# Altium project 红眼.PrjPcb
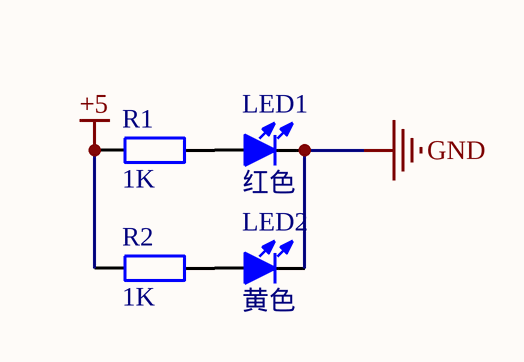
[diagram p0: Sheet1.SchDoc]
1 sheet, 4 parts. Net scope: global (net labels, ports and power ports of the same name join across sheets).
Board file: PCB1.PcbDoc

## Sheet Sheet1.SchDoc
size A4

### Parts
LED1  红色  [LED 0805G]
LED2  黄色  [LED 0805G]
R1  1K  [R 0805_L]
R2  1K  [R 0805_L]

### Nets
+5: R1.2 R2.2
GND: LED1.2(K) LED2.2(K)
NetLED1_1: LED1.1(A) R1.1
NetLED2_1: LED2.1(A) R2.1

### Library data of the parts
LED1 LED2 = LED-SMD: 贴片LED; 版权归属: 源创客; BOM名称: 贴片LED; 学习资源: www.ooocke.com
R1 R2 = R: 贴片电阻; 版权归属: 源创客; BOM名称: 贴片电阻; 学习资源: www.ooocke.com